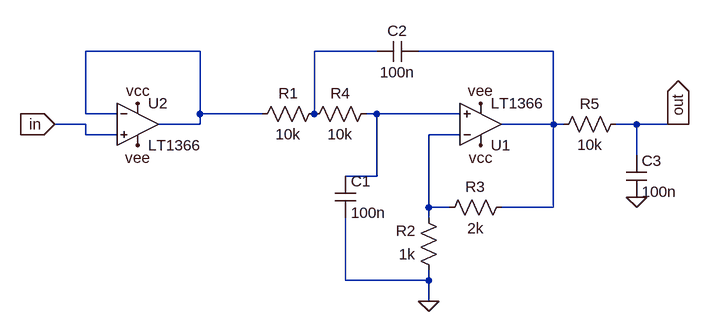
[diagram p0: schematic vcf.asc]
vcf.asc, the LTspice schematic file:
Version 4
SHEET 1 880 680
WIRE 48 144 -128 144
WIRE 320 144 224 144
WIRE 592 144 384 144
WIRE -128 240 -128 144
WIRE -80 240 -128 240
WIRE 48 240 48 144
WIRE 144 240 48 240
WIRE 224 240 224 144
WIRE 320 240 304 240
WIRE 448 240 320 240
WIRE -128 256 -176 256
WIRE 48 256 48 240
WIRE 48 256 -16 256
WIRE 592 256 592 144
WIRE 592 256 512 256
WIRE 608 256 592 256
WIRE 720 256 688 256
WIRE 784 256 720 256
WIRE 800 256 784 256
WIRE -128 272 -128 256
WIRE -80 272 -128 272
WIRE 448 272 400 272
WIRE 720 304 720 256
WIRE 320 336 320 240
WIRE 320 336 272 336
WIRE 400 384 400 272
WIRE 432 384 400 384
WIRE 592 384 592 256
WIRE 592 384 512 384
WIRE 400 400 400 384
WIRE 272 496 272 400
WIRE 400 496 400 480
WIRE 400 496 272 496
WIRE 400 528 400 496
FLAG 400 528 0
FLAG 480 224 vee
FLAG 480 288 vcc
FLAG -176 256 in
IOPIN -176 256 In
FLAG 720 368 0
FLAG 784 256 out
IOPIN 784 256 Out
FLAG -48 224 vcc
FLAG -48 288 vee
SYMBOL Opamps/LT1366 480 320 M180
SYMATTR InstName U1
SYMBOL res 240 224 R90
WINDOW 0 0 56 VBottom 2
WINDOW 3 32 56 VTop 2
SYMATTR InstName R1
SYMATTR Value 10k
SYMBOL res 416 496 R180
WINDOW 0 36 76 Left 2
WINDOW 3 36 40 Left 2
SYMATTR InstName R2
SYMATTR Value 1k
SYMBOL res 416 400 R270
WINDOW 0 32 56 VTop 2
WINDOW 3 0 56 VBottom 2
SYMATTR InstName R3
SYMATTR Value 2k
SYMBOL cap 256 336 R0
SYMATTR InstName C1
SYMATTR Value 100n
SYMBOL res 320 224 R90
WINDOW 0 0 56 VBottom 2
WINDOW 3 32 56 VTop 2
SYMATTR InstName R4
SYMATTR Value 10k
SYMBOL cap 384 128 R90
WINDOW 0 0 32 VBottom 2
WINDOW 3 32 32 VTop 2
SYMATTR InstName C2
SYMATTR Value 100n
SYMBOL res 704 240 R90
WINDOW 0 0 56 VBottom 2
WINDOW 3 32 56 VTop 2
SYMATTR InstName R5
SYMATTR Value 10k
SYMBOL cap 704 304 R0
SYMATTR InstName C3
SYMATTR Value 100n
SYMBOL Opamps/LT1366 -48 192 R0
SYMATTR InstName U2

The netlist it stands for:
* vcf.asc
XU1 N004 N005 vcc vee N003 LT1366  ; pins In+ In- V+ V- OUT
R1 N002 N001 10k
R2 0 N005 1k
R3 N005 N003 2k
C1 N004 0 100n
R4 N004 N002 10k
C2 N003 N002 100n
R5 out N003 10k
C3 out 0 100n
XU2 in N001 vcc vee N001 LT1366  ; pins In+ In- V+ V- OUT
.lib LTC.lib
.backanno
.end